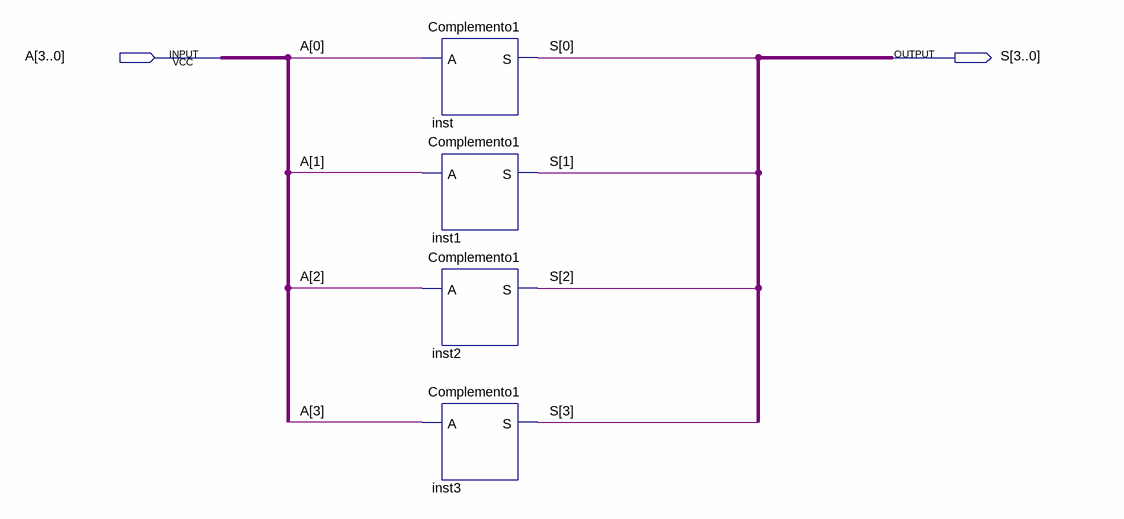
[diagram p0: schematic sheet]
// Quartus schematic Complemento1_4bits.bdf as structural Verilog: 4 symbols, 2 pins
module Complemento1_4bits (
  input  [3:0] A,
  output [3:0] S
);

  Complemento1 inst (.A(A[0]), .S(S[0]));
  Complemento1 inst1 (.A(A[1]), .S(S[1]));
  Complemento1 inst2 (.A(A[2]), .S(S[2]));
  Complemento1 inst3 (.A(A[3]), .S(S[3]));
endmodule
